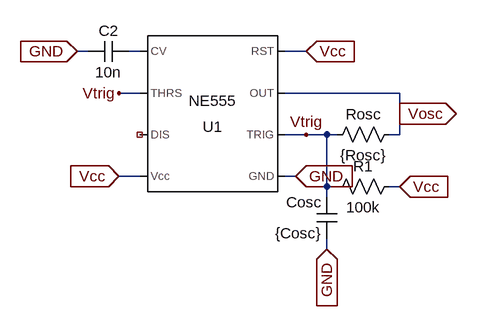
[diagram p0: schematic oscillator.asc]
oscillator.asc, the LTspice schematic file:
Version 4
SHEET 1 880 680
WIRE 64 64 48 64
WIRE 144 64 128 64
WIRE 400 64 368 64
WIRE 144 128 112 128
WIRE 544 128 368 128
WIRE 544 160 544 128
WIRE 400 192 368 192
WIRE 432 192 400 192
WIRE 448 192 432 192
WIRE 544 192 544 160
WIRE 544 192 528 192
WIRE 144 256 112 256
WIRE 384 256 368 256
WIRE 432 272 432 192
WIRE 448 272 432 272
WIRE 544 272 528 272
WIRE 432 288 432 272
WIRE 432 368 432 352
FLAG 400 64 Vcc
IOPIN 400 64 In
FLAG 112 256 Vcc
IOPIN 112 256 In
FLAG 544 160 Vosc
IOPIN 544 160 Out
FLAG 544 272 Vcc
IOPIN 544 272 In
FLAG 400 192 Vtrig
FLAG 384 256 GND
IOPIN 384 256 In
FLAG 432 368 GND
IOPIN 432 368 In
FLAG 112 128 Vtrig
FLAG 48 64 GND
IOPIN 48 64 In
SYMBOL Misc\\NE555 256 160 R180
SYMATTR InstName U1
SYMBOL res 544 256 R90
WINDOW 0 0 56 VBottom 2
WINDOW 3 32 56 VTop 2
SYMATTR InstName R1
SYMATTR Value 100k
SYMBOL res 544 176 R90
WINDOW 0 0 56 VBottom 2
WINDOW 3 32 56 VTop 2
SYMATTR InstName Rosc
SYMATTR Value {Rosc}
SYMBOL cap 448 352 R180
WINDOW 0 24 56 Left 2
WINDOW 3 24 8 Left 2
SYMATTR InstName Cosc
SYMATTR Value {Cosc}
SYMBOL cap 128 48 R90
WINDOW 0 0 32 VBottom 2
WINDOW 3 32 32 VTop 2
SYMATTR InstName C2
SYMATTR Value 10n

The netlist it stands for:
* oscillator.asc
XU1 GND Vtrig Vosc Vcc N001 Vtrig NC_01 Vcc NE555  ; pins GND TRIG OUT RST CV THRS DIS Vcc
R1 Vcc Vtrig 100k
Rosc Vosc Vtrig {Rosc}
Cosc GND Vtrig {Cosc}
C2 N001 GND 10n
.lib NE555.sub
.backanno
.end